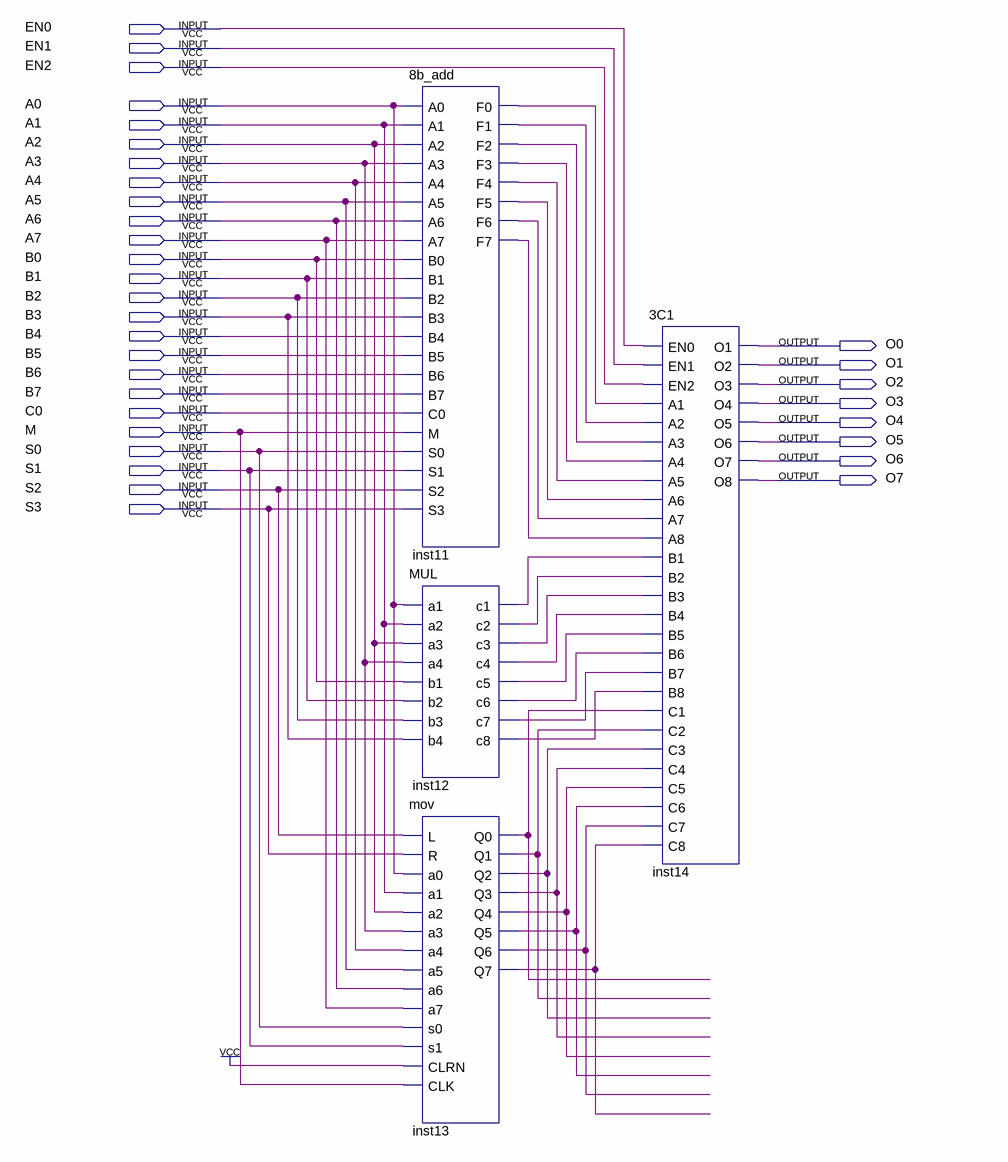
[diagram p0: schematic sheet]
// Quartus schematic ALU.bdf as structural Verilog: 4 symbols, 33 pins
module ALU (
  input  EN0,
  input  EN1,
  input  EN2,
  input  A0,
  input  A1,
  input  A2,
  input  A3,
  input  A4,
  input  A5,
  input  A6,
  input  A7,
  input  B0,
  input  B1,
  input  B2,
  input  B3,
  input  B4,
  input  B5,
  input  B6,
  input  B7,
  input  C0,
  input  M,
  input  S0,
  input  S1,
  input  S2,
  input  S3,
  output O0,
  output O1,
  output O2,
  output O3,
  output O4,
  output O5,
  output O6,
  output O7
);

  wire inst11_f0, inst11_f1, inst11_f2, inst11_f3, inst11_f4, inst11_f5, inst11_f6, inst11_f7, inst12_c1,
       inst12_c2, inst12_c3, inst12_c4, inst12_c5, inst12_c6, inst12_c7, inst12_c8, inst13_q0, inst13_q1,
       inst13_q2, inst13_q3, inst13_q4, inst13_q5, inst13_q6, inst13_q7;

  \8b_add  inst11 (
    .A0(A0), .A1(A1), .A2(A2), .A3(A3), .A4(A4), .A5(A5), .A6(A6), .A7(A7), .B0(B0), .B1(B1), .B2(B2),
    .B3(B3), .B4(B4), .B5(B5), .B6(B6), .B7(B7), .C0(C0), .M(M), .S0(S0), .S1(S1), .S2(S2), .S3(S3),
    .F0(inst11_f0), .F1(inst11_f1), .F2(inst11_f2), .F3(inst11_f3), .F4(inst11_f4), .F5(inst11_f5),
    .F6(inst11_f6), .F7(inst11_f7));
  MUL inst12 (
    .a1(A0), .a2(A1), .a3(A2), .a4(A3), .b1(B0), .b2(B1), .b3(B2), .b4(B3), .c1(inst12_c1), .c2(inst12_c2),
    .c3(inst12_c3), .c4(inst12_c4), .c5(inst12_c5), .c6(inst12_c6), .c7(inst12_c7), .c8(inst12_c8));
  mov inst13 (
    .L(S2), .R(S3), .a0(A0), .a1(A1), .a2(A2), .a3(A3), .a4(A4), .a5(A5), .a6(A6), .a7(A7), .s0(S0), .s1(S1),
    .CLRN(1'b1), .CLK(M), .Q0(inst13_q0), .Q1(inst13_q1), .Q2(inst13_q2), .Q3(inst13_q3), .Q4(inst13_q4),
    .Q5(inst13_q5), .Q6(inst13_q6), .Q7(inst13_q7));
  \3C1  inst14 (
    .EN0(EN0), .EN1(EN1), .EN2(EN2), .A1(inst11_f0), .A2(inst11_f1), .A3(inst11_f2), .A4(inst11_f3),
    .A5(inst11_f4), .A6(inst11_f5), .A7(inst11_f6), .A8(inst11_f7), .B1(inst12_c1), .B2(inst12_c2),
    .B3(inst12_c3), .B4(inst12_c4), .B5(inst12_c5), .B6(inst12_c6), .B7(inst12_c7), .B8(inst12_c8),
    .C1(inst13_q0), .C2(inst13_q1), .C3(inst13_q2), .C4(inst13_q3), .C5(inst13_q4), .C6(inst13_q5),
    .C7(inst13_q6), .C8(inst13_q7), .O1(O0), .O2(O1), .O3(O2), .O4(O3), .O5(O4), .O6(O5), .O7(O6), .O8(O7));
endmodule
